# EAGLE schematic ESP01_SMD_0603 (EAGLE 9.6.2)
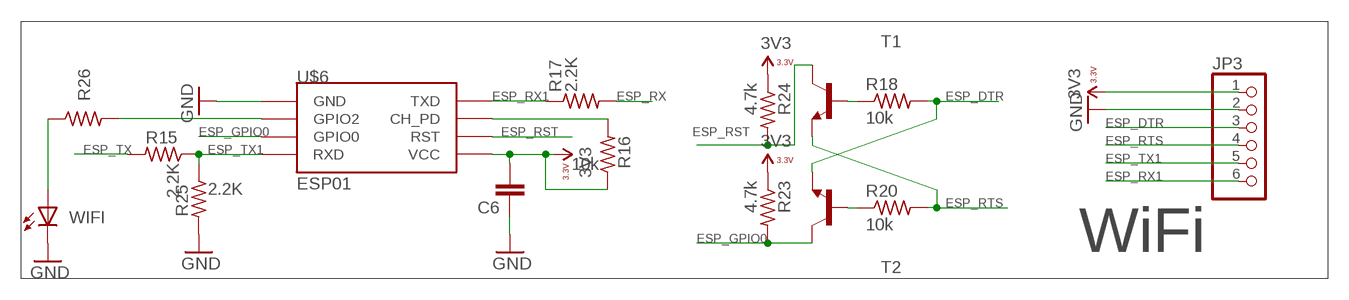
[diagram p0: schematic, sheet 1]

## Parts
C6  C-EU050-024X044  [C050-024X044]
JP3  PINHD-1X6  [1X06]
R15  2.2K  R-US_R0603  [R0603]
R16  10k  R-US_R0603  [R0603]
R17  2.2K  R-US_R0603  [R0603]
R18  10k  R-US_R0603  [R0603]
R20  10k  R-US_R0603  [R0603]
R23  4.7k  R-US_R0603  [R0603]
R24  4.7k  R-US_R0603  [R0603]
R25  2.2K  R-US_R0603  [R0603]
R26  R-US_R0603  [R0603]
T1  MMBT2222ALT1-NPN-SOT23-BEC  [SOT23-BEC]
T2  MMBT2222ALT1-NPN-SOT23-BEC  [SOT23-BEC]
U$6  ESP01  [ESP01]
WIFI  LEDCHIPLED_0603  [CHIPLED_0603]

## Nets
3V3: C6.2 JP3.1 R16.1 R23.1 R24.1 U$6.VCC
ESP_DTR: JP3.3 R18.2 T2.E
ESP_GPIO0: R23.2 T2.C U$6.GPIO0
ESP_RST: R24.2 T1.C U$6.RST
ESP_RTS: JP3.4 R20.2 T1.E
ESP_RX: R17.2
ESP_RX1: JP3.6 R17.1 U$6.TX(TXD)
ESP_TX: R15.2
ESP_TX1: JP3.5 R15.1 R25.1 U$6.RX(RXD)
GND: C6.1 JP3.2 R25.2 U$6.GND WIFI.C
N$9: R20.1 T2.B
N$11: R18.1 T1.B
N$13: R16.2 U$6.CH_PD
N$16: R26.2 U$6.GPIO2
N$26: R26.1 WIFI.A

## Notes on the sheet
- WiFi

## Library data of the parts
C6 = rcl:C-EU: CAPACITOR, European symbol
JP3 = pinhead:PINHD-1X6: PIN HEADER
R15-R18 R20 R23-R26 = rcl:R-US_: RESISTOR, American symbol
T1 T2 = transistor:*-NPN-: NPN Transistror BF959 corrected 2008.03.06
U$6 = PatternAgents_RFmodules:ESP01: ESP8266 Wifi module 01
WIFI = led:LED: LED OSRAM: - CHIPLED LG R971, LG N971, LY N971, LG Q971, LY Q971, LO R971, LY R971 LH N974, LH R974 LS Q976, LO Q976, LY Q976 LO Q996 - Hyper CHIPLED LW Q18S LB Q993, LB Q99A, LB R99A - SideLED LS A670, LO A670, LY A670, LG A670, LP A670 LB A673, LV A673, LT A673, LW A673 LH A674 LY A675 LS A676, LA A676, LO A676, LY A676, LW A676 LS A679, LY A679, LG A679 - Hyper Micro SIDELED® LS Y876, LA Y876, LO Y876, LY Y876 LT Y87S - SmartLED LW L88C, LW L88S LB L89C, LB L89S, LG L890 LS L89K, LO L89K, LY L89K LS L896, LA L896, LO L896, LY L896 - TOPLED LS T670, LO T670, LY T670, LG T670, LP T670 LSG T670, LSP T670, LSY T670, LOP T670, LYG T670 LG T671, LOG T671, LSG T671 LB T673, LV T673, LT T673, LW T673 LH T674 LS T676, LA T676, LO T676, LY T676, LB T676, LH T676, LSB T676, LW T676 LB T67C, LV T67C, LT T67C, LS T67K, LO T67K, LY T67K, LW E67C LS E67B, LA E67B, LO E67B, LY E67B, LB E67C, LV E67C, LT E67C LW T67C LS T679, LY T679, LG T679 LS T770, LO T770, LY T770, LG T770, LP T770 LB T773, LV T773, LT T773, LW T773 LH T774 LS E675, LA E675, LY E675, LS T675 LS T776, LA T776, LO T776, LY T776, LB T776 LHGB T686 LT T68C, LB T68C - Hyper Mini TOPLED® LB M676 - Mini TOPLED Santana® LG M470 LS M47K, LO M47K, LY M47K Source: http://www.osram.convergy.de LUXEON: - LUMILED® LXK2-PW12-R00, LXK2-PW12-S00, LXK2-PW14-U00, LXK2-PW14-V00 LXK2-PM12-R00, LXK2-PM12-S00, LXK2-PM14-U00 LXK2-PE12-Q00, LXK2-PE12-R00, LXK2-PE12-S00, LXK2-PE14-T00, LXK2-PE14-U00 LXK2-PB12-K00, LXK2-PB12-L00, LXK2-PB12-M00, LXK2-PB14-N00, LXK2-PB14-P00, LXK2-PB14-Q00 LXK2-PR12-L00, LXK2-PR12-M00, LXK2-PR14-Q00, LXK2-PR14-R00 LXK2-PD12-Q00, LXK2-PD12-R00, LXK2-PD12-S00 LXK2-PH12-R00, LXK2-PH12-S00 LXK2-PL12-P00, LXK2-PL12-Q00, LXK2-PL12-R00 Source: www.luxeon.com KINGBRIGHT: KA-3528ASYC Source: www.kingbright.com